# EAGLE design Laser_Array_Temp_Low_BRD_V2.2 (EAGLE 7.7.0)
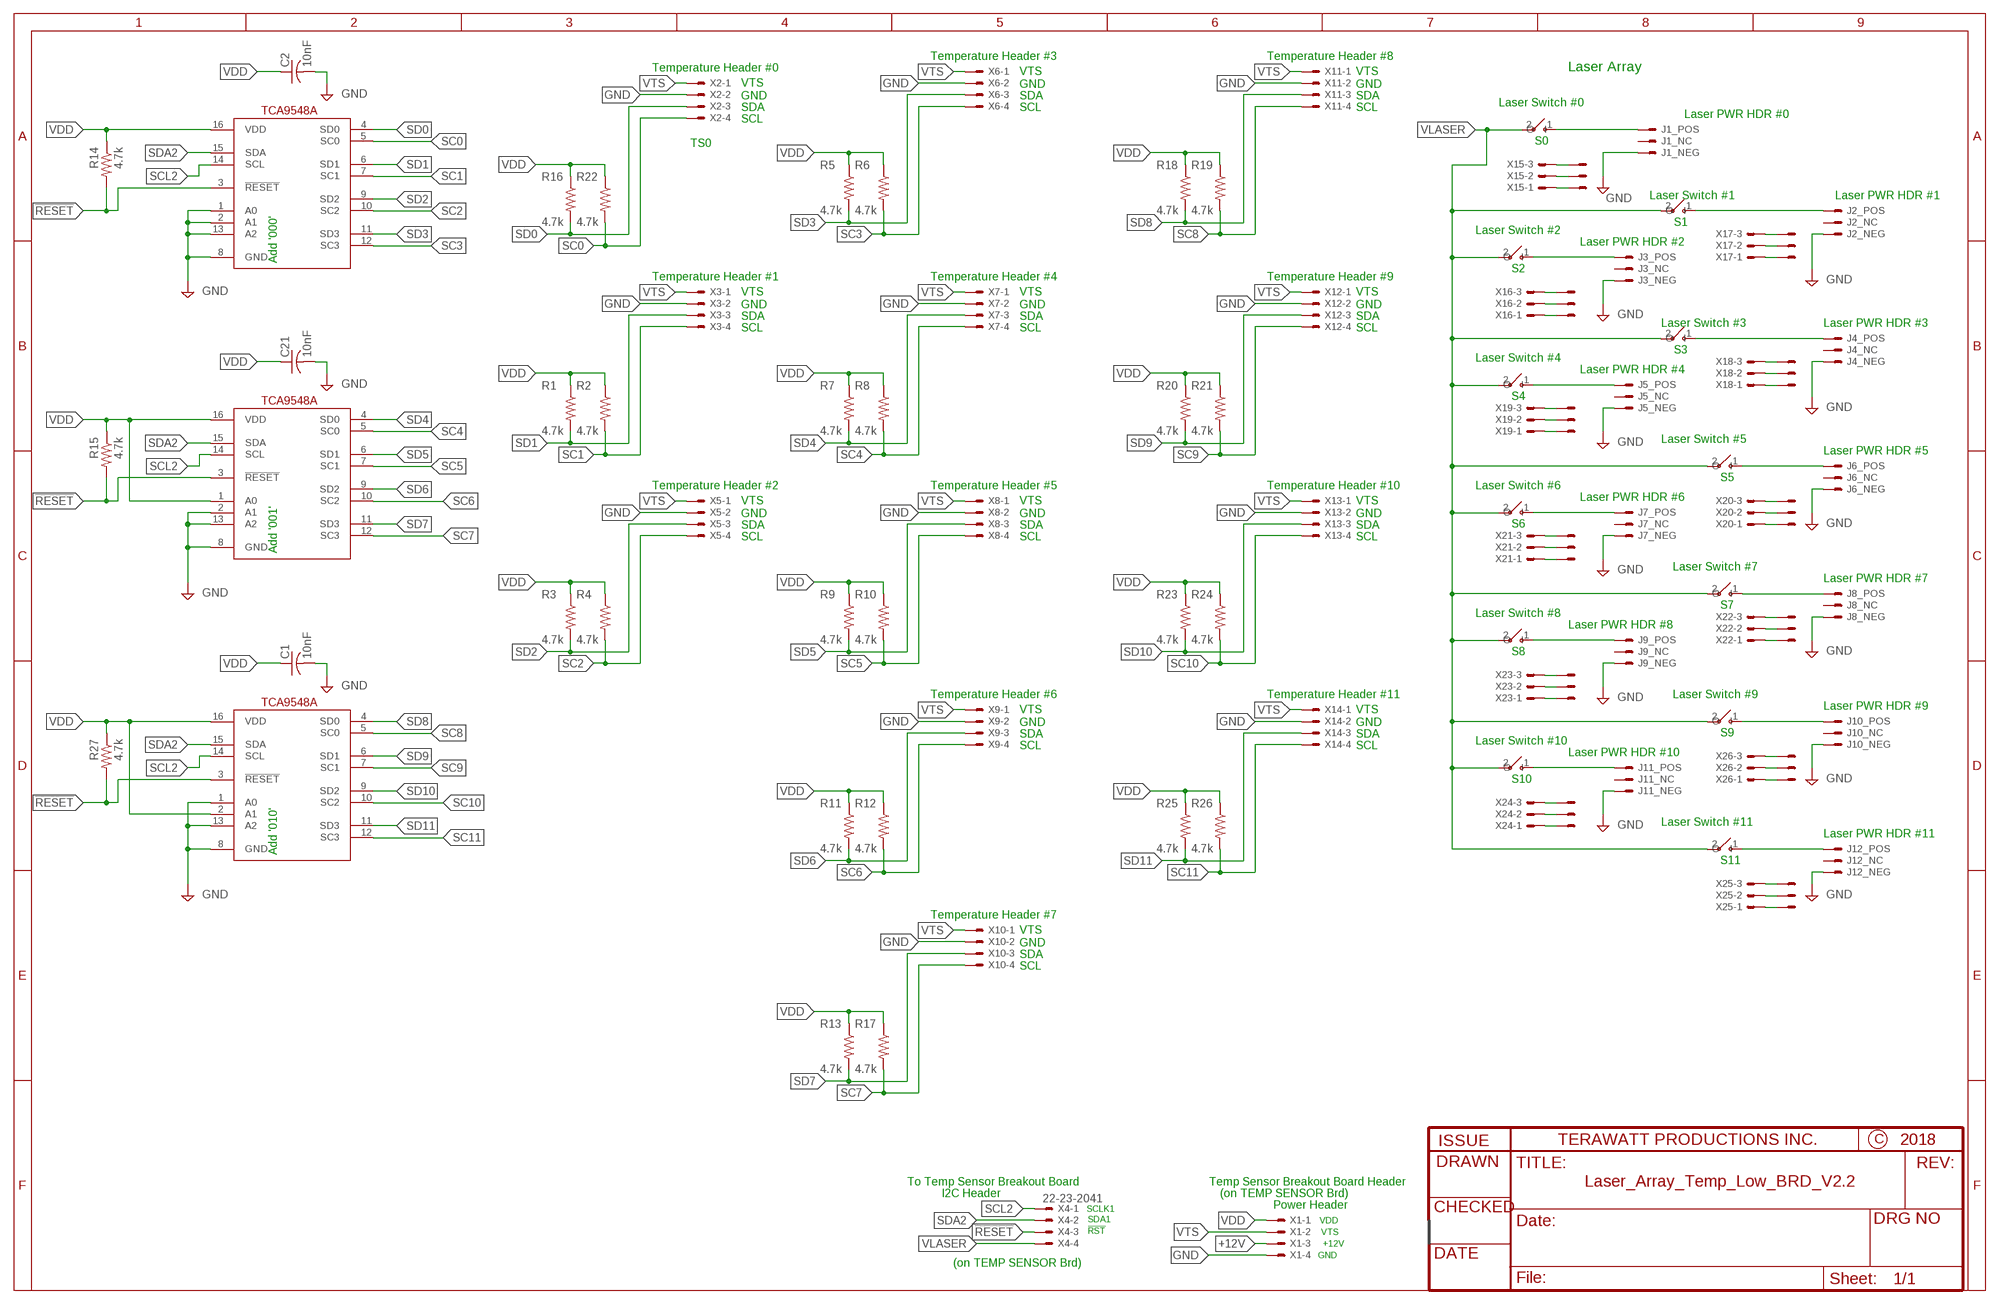
[diagram p0: schematic, sheet 1]

## Parts
C1  10nF  C-USC0805  [C0805]
C2  10nF  C-USC0805  [C0805]
C21  10nF  C-USC0805  [C0805]
J1  LASER_MOD  [LASER_MOD]
J2  LASER_MOD  [LASER_MOD]
J3  LASER_MOD  [LASER_MOD]
J4  LASER_MOD  [LASER_MOD]
J5  LASER_MOD  [LASER_MOD]
J6  LASER_MOD  [LASER_MOD]
J7  LASER_MOD  [LASER_MOD]
J8  LASER_MOD  [LASER_MOD]
J9  LASER_MOD  [LASER_MOD]
J10  LASER_MOD  [LASER_MOD]
J11  LASER_MOD  [LASER_MOD]
J12  LASER_MOD  [LASER_MOD]
R1  4.7k  R-US_M0805  [M0805]
R2  4.7k  R-US_M0805  [M0805]
R3  4.7k  R-US_M0805  [M0805]
R4  4.7k  R-US_M0805  [M0805]
R5  4.7k  R-US_M0805  [M0805]
R6  4.7k  R-US_M0805  [M0805]
R7  4.7k  R-US_M0805  [M0805]
R8  4.7k  R-US_M0805  [M0805]
R9  4.7k  R-US_M0805  [M0805]
R10  4.7k  R-US_M0805  [M0805]
R11  4.7k  R-US_M0805  [M0805]
R12  4.7k  R-US_M0805  [M0805]
R13  4.7k  R-US_M0805  [M0805]
R14  4.7k  R-US_M0805  [M0805]
R15  4.7k  R-US_M0805  [M0805]
R16  4.7k  R-US_M0805  [M0805]
R17  4.7k  R-US_M0805  [M0805]
R18  4.7k  R-US_M0805  [M0805]
R19  4.7k  R-US_M0805  [M0805]
R20  4.7k  R-US_M0805  [M0805]
R21  4.7k  R-US_M0805  [M0805]
R22  4.7k  R-US_M0805  [M0805]
R23  4.7k  R-US_M0805  [M0805]
R24  4.7k  R-US_M0805  [M0805]
R25  4.7k  R-US_M0805  [M0805]
R26  4.7k  R-US_M0805  [M0805]
R27  4.7k  R-US_M0805  [M0805]
S13  TOGGLE_SPST  [22-23-2021]
S14  TOGGLE_SPST  [22-23-2021]
S15  TOGGLE_SPST  [22-23-2021]
S16  TOGGLE_SPST  [22-23-2021]
S17  TOGGLE_SPST  [22-23-2021]
S18  TOGGLE_SPST  [22-23-2021]
S19  TOGGLE_SPST  [22-23-2021]
S20  TOGGLE_SPST  [22-23-2021]
S21  TOGGLE_SPST  [22-23-2021]
S22  TOGGLE_SPST  [22-23-2021]
S23  TOGGLE_SPST  [22-23-2021]
S24  TOGGLE_SPST  [22-23-2021]
U1  TCA9546A  [SOIC16N]
U2  TCA9546A  [SOIC16N]
U3  TCA9546A  [SOIC16N]
U$1  SINGLE_PAD  [SINGLE_PAD]
U$2  SINGLE_PAD  [SINGLE_PAD]
U$3  SINGLE_PAD  [SINGLE_PAD]
U$4  SINGLE_PAD  [SINGLE_PAD]
U$5  SINGLE_PAD  [SINGLE_PAD]
U$6  SINGLE_PAD  [SINGLE_PAD]
U$7  SINGLE_PAD  [SINGLE_PAD]
U$8  SINGLE_PAD  [SINGLE_PAD]
U$9  SINGLE_PAD  [SINGLE_PAD]
U$10  SINGLE_PAD  [SINGLE_PAD]
U$11  SINGLE_PAD  [SINGLE_PAD]
U$12  SINGLE_PAD  [SINGLE_PAD]
U$13  SINGLE_PAD  [SINGLE_PAD]
U$14  SINGLE_PAD  [SINGLE_PAD]
U$15  SINGLE_PAD  [SINGLE_PAD]
U$16  SINGLE_PAD  [SINGLE_PAD]
U$17  SINGLE_PAD  [SINGLE_PAD]
U$18  SINGLE_PAD  [SINGLE_PAD]
U$19  SINGLE_PAD  [SINGLE_PAD]
U$20  SINGLE_PAD  [SINGLE_PAD]
U$21  SINGLE_PAD  [SINGLE_PAD]
U$22  SINGLE_PAD  [SINGLE_PAD]
U$23  SINGLE_PAD  [SINGLE_PAD]
U$24  SINGLE_PAD  [SINGLE_PAD]
U$25  SINGLE_PAD  [SINGLE_PAD]
U$26  SINGLE_PAD  [SINGLE_PAD]
U$27  SINGLE_PAD  [SINGLE_PAD]
U$28  SINGLE_PAD  [SINGLE_PAD]
U$29  SINGLE_PAD  [SINGLE_PAD]
U$30  SINGLE_PAD  [SINGLE_PAD]
U$31  SINGLE_PAD  [SINGLE_PAD]
U$32  SINGLE_PAD  [SINGLE_PAD]
U$33  SINGLE_PAD  [SINGLE_PAD]
U$34  SINGLE_PAD  [SINGLE_PAD]
U$35  SINGLE_PAD  [SINGLE_PAD]
U$36  SINGLE_PAD  [SINGLE_PAD]
X1  22-23-2041  [22-23-2041]
X2  22-23-2041  [22-23-2041]
X3  22-23-2041  [22-23-2041]
X4  22-23-2041  [22-23-2041]
X5  22-23-2041  [22-23-2041]
X6  22-23-2041  [22-23-2041]
X7  22-23-2041  [22-23-2041]
X8  22-23-2041  [22-23-2041]
X9  22-23-2041  [22-23-2041]
X10  22-23-2041  [22-23-2041]
X11  22-23-2041  [22-23-2041]
X12  22-23-2041  [22-23-2041]
X13  22-23-2041  [22-23-2041]
X14  22-23-2041  [22-23-2041]
X15  22-23-2031  [22-23-2031]
X16  22-23-2031  [22-23-2031]
X17  22-23-2031  [22-23-2031]
X18  22-23-2031  [22-23-2031]
X19  22-23-2031  [22-23-2031]
X20  22-23-2031  [22-23-2031]
X21  22-23-2031  [22-23-2031]
X22  22-23-2031  [22-23-2031]
X23  22-23-2031  [22-23-2031]
X24  22-23-2031  [22-23-2031]
X25  22-23-2031  [22-23-2031]
X26  22-23-2031  [22-23-2031]

## Nets
!RESET: R14.2 R15.2 R27.2 U1.3(!RESET) U2.3(!RESET) U3.3(!RESET) X4.3
+12V: X1.3
GND: C1.2 C2.2 C21.2 J1.3 J2.3 J3.3 J4.3 J5.3 J6.3 J7.3 J8.3 J9.3 J10.3 J11.3 J12.3 U1.1(A0) U1.2(A1) U1.8(GND) U1.13(A2) U2.2(A1) U2.8(GND) U2.13(A2) U3.1(A0) U3.8(GND) U3.13(A2) X1.4 X2.2 X3.2 X5.2 X6.2 X7.2 X8.2 X9.2 X10.2 X11.2 X12.2 X13.2 X14.2
N$1: J2.1 S13.1(O)
N$2: J1.1 S16.1(O)
N$3: J3.1 S14.1(O)
N$4: J4.1 S15.1(O)
N$5: J5.1 S17.1(O)
N$6: J6.1 S18.1(O)
N$7: J7.1 S19.1(O)
N$8: J8.1 S20.1(O)
N$9: J9.1 S21.1(O)
N$10: J10.1 S22.1(O)
N$11: J11.1 S23.1(O)
N$12: J12.1 S24.1(O)
N$13: U$4.1(S) X16.3
N$14: U$1.1(S) X15.3
N$15: U$10.1(S) X18.3
N$16: U$13.1(S) X19.3
N$17: U$7.1(S) X17.3
N$18: U$16.1(S) X20.3
N$19: U$19.1(S) X21.3
N$20: U$2.1(S) X15.2
N$21: U$3.1(S) X15.1
N$22: U$5.1(S) X16.2
N$23: U$6.1(S) X16.1
N$24: U$8.1(S) X17.2
N$25: U$9.1(S) X17.1
N$26: U$11.1(S) X18.2
N$27: U$12.1(S) X18.1
N$28: U$14.1(S) X19.2
N$29: U$15.1(S) X19.1
N$30: U$17.1(S) X20.2
N$31: U$18.1(S) X20.1
N$32: U$20.1(S) X21.2
N$33: U$21.1(S) X21.1
N$34: U$22.1(S) X22.3
N$35: U$23.1(S) X22.2
N$36: U$24.1(S) X22.1
N$37: U$25.1(S) X23.3
N$38: U$26.1(S) X23.2
N$39: U$27.1(S) X23.1
N$40: U$28.1(S) X24.3
N$41: U$29.1(S) X24.2
N$42: U$30.1(S) X24.1
N$43: U$31.1(S) X25.3
N$44: U$32.1(S) X25.2
N$45: U$33.1(S) X25.1
N$46: U$34.1(S) X26.3
N$47: U$35.1(S) X26.2
N$48: U$36.1(S) X26.1
SC0: R22.2 U1.5(SC0) X2.4
SC1: R2.2 U1.7(SC1) X3.4
SC2: R4.2 U1.10(SC2) X5.4
SC3: R6.2 U1.12(SC3) X6.4
SC4: R8.2 U2.5(SC0) X7.4
SC5: R10.2 U2.7(SC1) X8.4
SC6: R12.2 U2.10(SC2) X9.4
SC7: R17.2 U2.12(SC3) X10.4
SC8: R19.2 U3.5(SC0) X11.4
SC9: R21.2 U3.7(SC1) X12.4
SC10: R24.2 U3.10(SC2) X13.4
SC11: R26.2 U3.12(SC3) X14.4
SCL2: U1.14(SCL) U2.14(SCL) U3.14(SCL) X4.1
SD0: R16.2 U1.4(SD0) X2.3
SD1: R1.2 U1.6(SD1) X3.3
SD2: R3.2 U1.9(SD2) X5.3
SD3: R5.2 U1.11(SD3) X6.3
SD4: R7.2 U2.4(SD0) X7.3
SD5: R9.2 U2.6(SD1) X8.3
SD6: R11.2 U2.9(SD2) X9.3
SD7: R13.2 U2.11(SD3) X10.3
SD8: R18.2 U3.4(SD0) X11.3
SD9: R20.2 U3.6(SD1) X12.3
SD10: R23.2 U3.9(SD2) X13.3
SD11: R25.2 U3.11(SD3) X14.3
SDA2: U1.15(SDA) U2.15(SDA) U3.15(SDA) X4.2
VDD: C1.1 C2.1 C21.1 R1.1 R2.1 R3.1 R4.1 R5.1 R6.1 R7.1 R8.1 R9.1 R10.1 R11.1 R12.1 R13.1 R14.1 R15.1 R16.1 R17.1 R18.1 R19.1 R20.1 R21.1 R22.1 R23.1 R24.1 R25.1 R26.1 R27.1 U1.16(VDD) U2.1(A0) U2.16(VDD) U3.2(A1) U3.16(VDD) X1.1
VLASER: S13.2(I) S14.2(I) S15.2(I) S16.2(I) S17.2(I) S18.2(I) S19.2(I) S20.2(I) S21.2(I) S22.2(I) S23.2(I) S24.2(I) X4.4
VTS: X1.2 X2.1 X3.1 X5.1 X6.1 X7.1 X8.1 X9.1 X10.1 X11.1 X12.1 X13.1 X14.1
Unconnected: J1.2 J2.2 J3.2 J4.2 J5.2 J6.2 J7.2 J8.2 J9.2 J10.2 J11.2 J12.2

## Notes on the sheet
- Temperature Header #3 | Temperature Header #8
- Temperature Header #0 | Laser Array
- VTS | VTS
- VTS | GND | GND
- GND | SDA | SDA
- Laser Switch #0
- SDA | SCL | SCL
- Laser PWR HDR #0
- SCL
- TS0 | S0
- Laser Switch #1 | Laser PWR HDR #1
- S1
- Laser Switch #2
- Laser PWR HDR #2
- Add '000'
- S2
- Temperature Header #1 | Temperature Header #4 | Temperature Header #9
- VTS | VTS | VTS
- GND | GND | GND
- SDA | SDA | SDA
- Laser Switch #3 | Laser PWR HDR #3
- SCL | SCL | SCL
- S3
- Laser Switch #4
- Laser PWR HDR #4
- S4
- Laser Switch #5
- Laser PWR HDR #5
- S5
- Temperature Header #2 | Temperature Header #5 | Temperature Header #10 | Laser Switch #6
- Laser PWR HDR #6
- VTS | VTS | VTS
- GND | GND | GND
- SDA | SDA | SDA | S6
- SCL | SCL | SCL
- Add '001'
- Laser Switch #7
- Laser PWR HDR #7
- S7
- Laser Switch #8
- Laser PWR HDR #8
- S8
- Temperature Header #6 | Temperature Header #11 | Laser Switch #9
- Laser PWR HDR #9
- VTS | VTS
- GND | GND
- SDA | SDA | S9
- Laser Switch #10
- SCL | SCL
- Laser PWR HDR #10
- S10
- Laser Switch #11
- Laser PWR HDR #11
- Add '010'
- S11
- Temperature Header #7
- VTS
- GND
- SDA
- SCL
- To Temp Sensor Breakout Board | Temp Sensor Breakout Board Header
- I2C Header | (on TEMP SENSOR Brd)
- Power Header
- SCLK1
- SDA1 | VDD
- !RST | VTS
- +12V
- GND
- (on TEMP SENSOR Brd)

## Library data of the parts
C1 C2 C21 = rcl:C-US: CAPACITOR, American symbol
J1-J12 = Mine:LASER_MOD
R1-R27 = rcl:R-US_: RESISTOR, American symbol
S13-S24 = Mine:TOGGLE_SPST: SPST Toggle SPST toggle switch with no package
U1-U3 = Mine:TCA9546A
U$1-U$36 = Mine:SINGLE_PAD
X1-X14 = Mine:22-23-2041: .100" (2.54mm) Center Header - 4 Pin; MF: MOLEX; MPN: 22-23-2041; OC_FARNELL: 1462920; OC_NEWARK: 38C0355
X15-X26 = Mine:22-23-2031: .100" (2.54mm) Center Header - 3 Pin; MF: MOLEX; MPN: 22-23-2031; OC_FARNELL: 1462950; OC_NEWARK: 30C0862

## Net classes
0 default: width 0.254 mm, drill 0.508 mm, clearance 0.203 mm

## Board
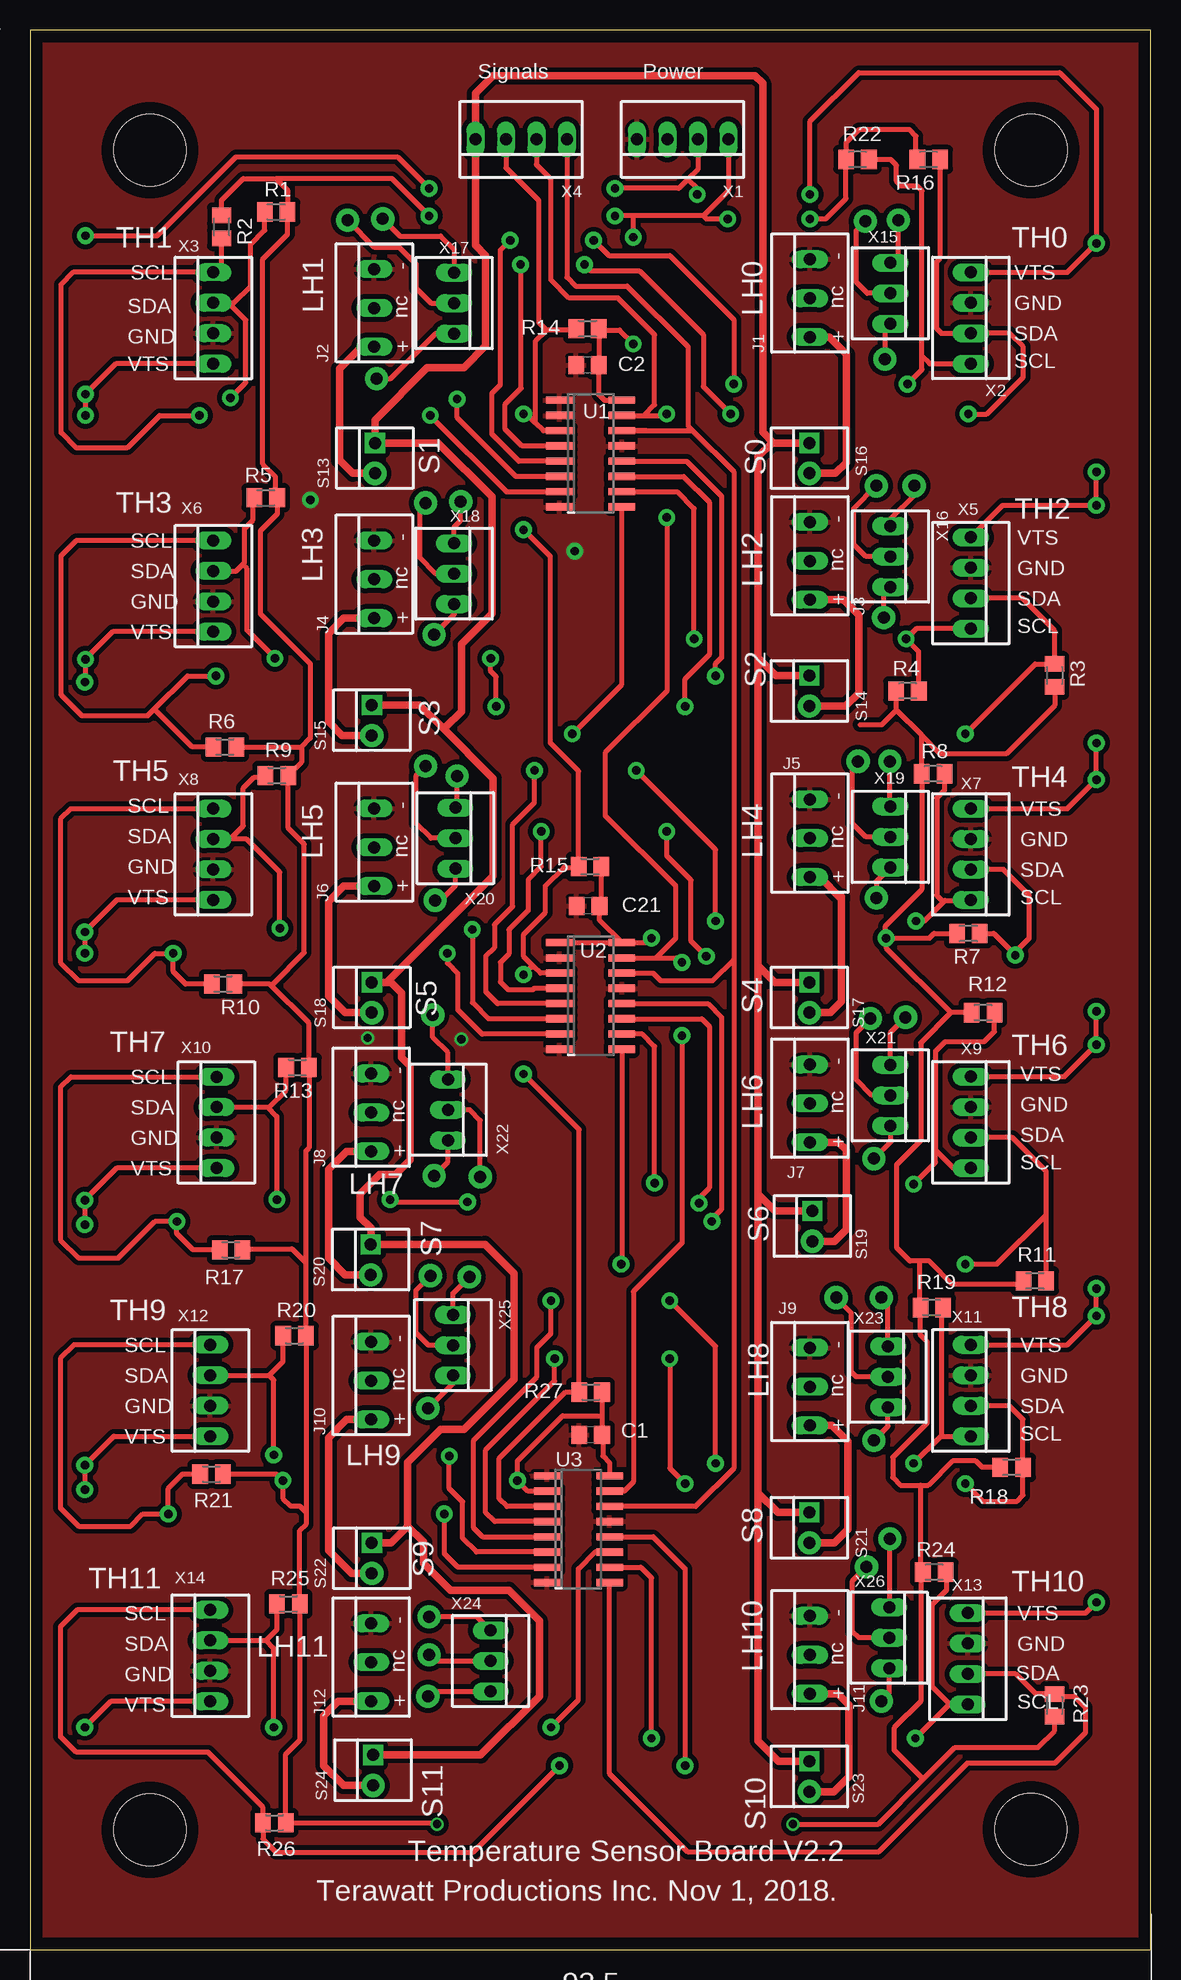
[diagram p1: board, top side]
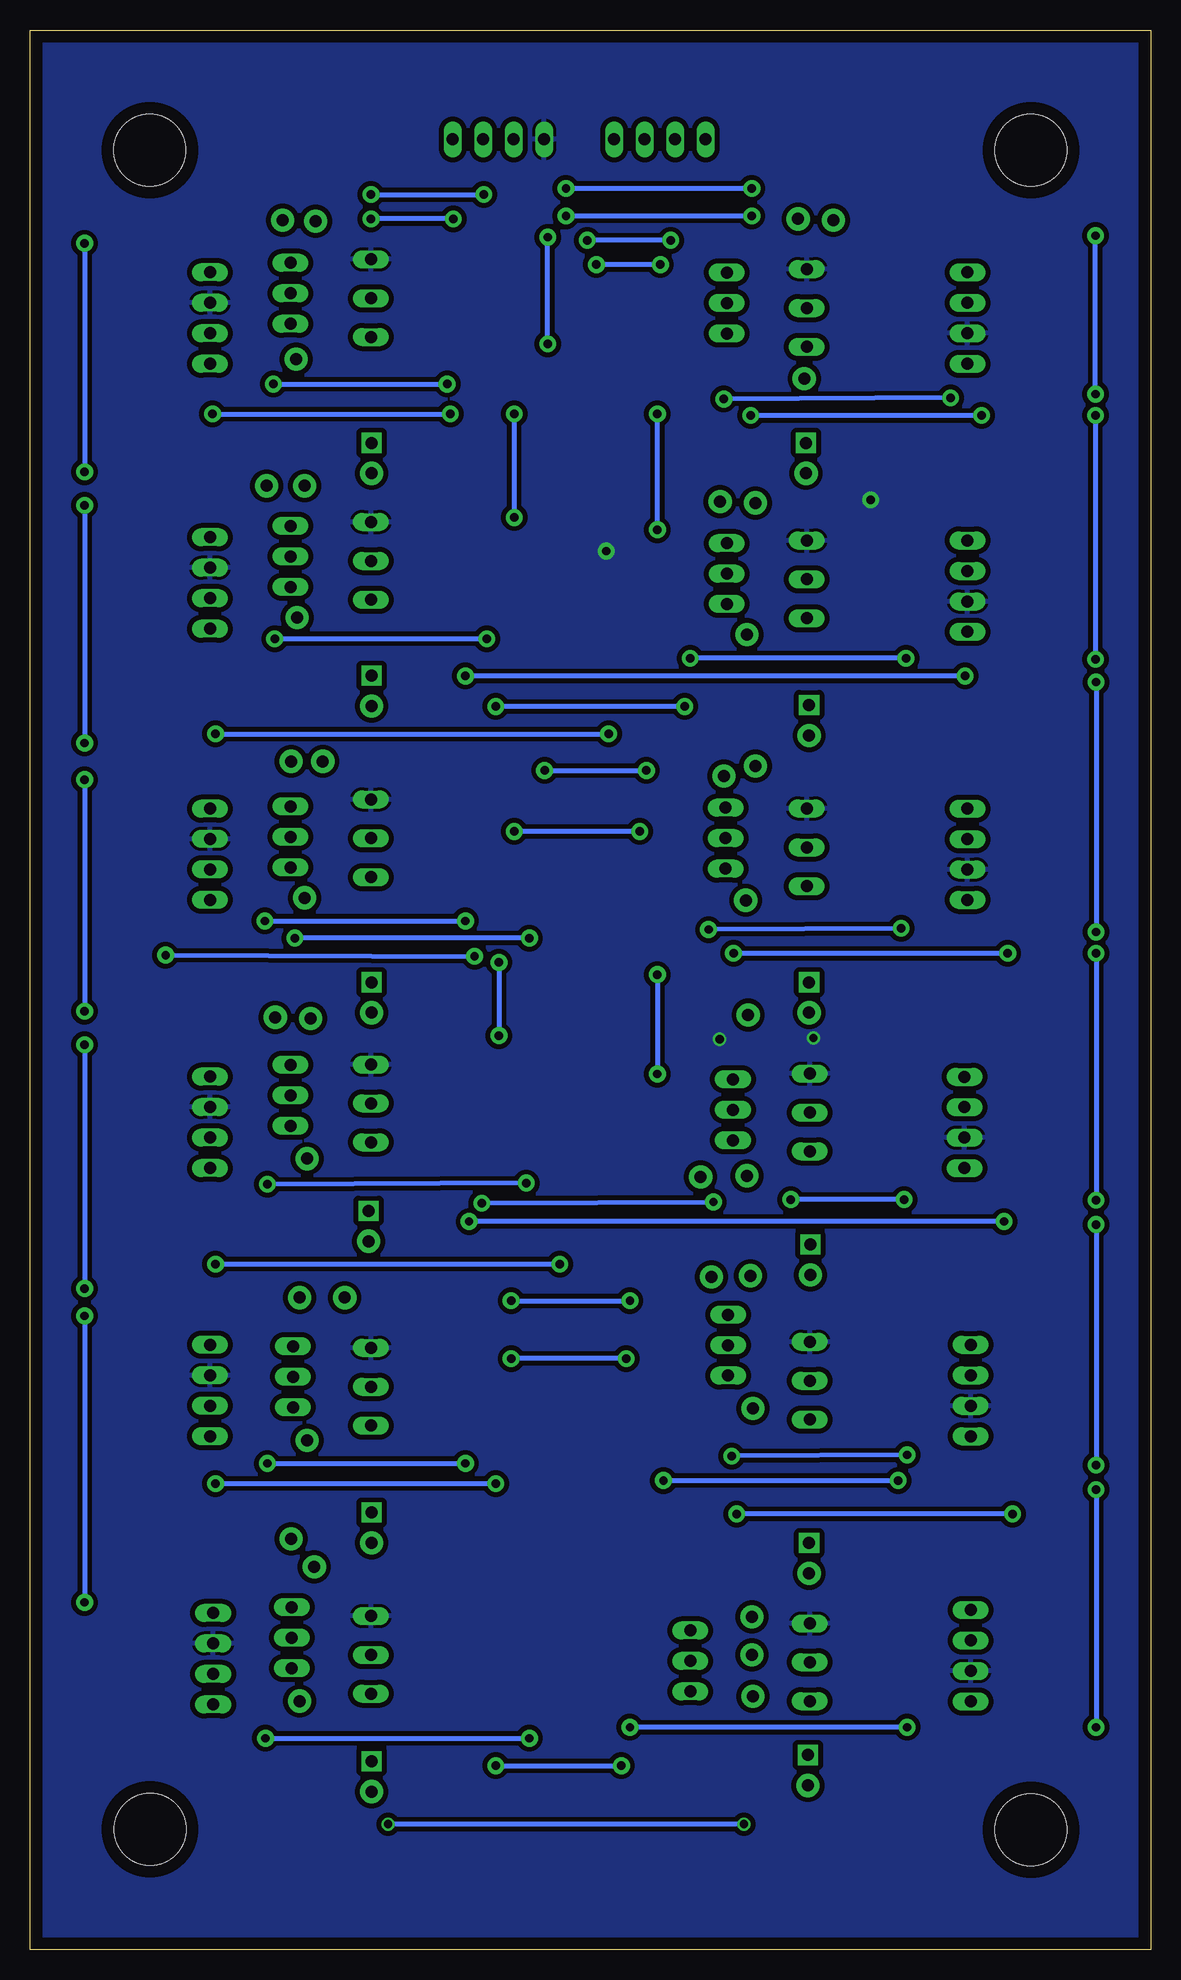
[diagram p2: board, bottom side, seen from below]

Size 93.45 x 160.02 mm. Coordinates in mm from the lower left corner, seen from the top.
Outline: 0,0 93.45,0 93.45,160.02 0,160.02 0,0
Copper layers (1*16): Top 0.035mm / dielectric 1.5mm / Bottom 0.035mm
Design rules "default *": minimum track width 10mil, minimum drill 24mil, track to track 16mil, track to pad 14mil, pad to pad 14mil, via to via 14mil, smd to smd 14mil, copper to edge 40mil, drill to drill 8mil, minimum pad ring 10mil, minimum via ring 8mil, stop-mask expansion 4mil, vias tented up to drill 0mil, thermal gap 10mil
Holes 5.99 mm at 10,10 10,150 83.44,10.04 83.46,150

### Footprints (pad centres in the part's own frame; a part is rotated, then mirrored left to right if it is on the bottom)
C0805 = smd 1.3 x 1.5: 1 -0.95,0; 2 0.95,0
LASER_MOD = drill 1 long: 1 -2.54,0; 2 0.7,0; 3 3.94,0
M0805 = smd 1.3 x 1.6: 1 -0.95,0; 2 0.95,0
22-23-2021 = drill 1 pad 1.93: 1 -1.27,0 | drill 1 pad 1.676 square: 2 1.27,0
SOIC16N = smd 0.6 x 2.2: 1 -4.445,-2.6; 2 -3.175,-2.6; 3 -1.905,-2.6; 4 -0.635,-2.6; 5 0.635,-2.6; 6 1.905,-2.6; 7 3.175,-2.6; 8 4.445,-2.6; 9 4.445,2.6; 10 3.175,2.6; 11 1.905,2.6; 12 0.635,2.6; 13 -0.635,2.6; 14 -1.905,2.6; 15 -3.175,2.6; 16 -4.445,2.6
SINGLE_PAD = drill 1 pad 1.93: 1 -1.27,0
22-23-2041 = drill 1 long: 1 -3.81,0; 2 -1.27,0; 3 1.27,0; 4 3.81,0
22-23-2031 = drill 1 long: 1 -2.54,0; 2 0,0; 3 2.54,0

### Placement (x,y rotation side)
C1  46.74,42.93 180 top
C2  46.48,132.08 180 top
C21  46.53,86.99 180 top
J1  65.02,136.96 90 top
J2  28.7,136.14 90 top
J3  65.02,115.06 90 top
J4  28.7,113.54 90 top
J5  65.02,91.95 90 top
J6  28.7,91.19 90 top
J7  65.02,69.85 90 top
J8  28.45,69.09 90 top
J9  65.02,46.23 90 top
J10  28.45,46.74 90 top
J11  65.02,23.88 90 top
J12  28.45,23.27 90 top
R1  20.52,144.86 180 top
R2  15.98,143.61 270 top
R3  85.42,106.22 90 top
R4  73.15,104.93 0 top
R5  19.66,121.03 180 top
R6  16.25,100.25 180 top
R7  78.23,84.71 0 top
R8  75.29,98.02 0 top
R9  20.58,97.87 180 top
R10  16.11,80.49 180 top
R11  83.77,55.75 0 top
R12  79.45,78.11 0 top
R13  22.3,73.53 180 top
R14  46.48,135.13 180 top
R15  46.69,90.3 180 top
R16  74.93,149.22 0 top
R17  16.77,58.34 180 top
R18  81.84,40.21 0 top
R19  75.18,53.52 0 top
R20  22.05,51.18 180 top
R21  15.14,39.65 180 top
R22  68.99,149.22 0 top
R23  85.42,20.37 90 top
R24  75.39,31.47 0 top
R25  21.54,28.83 180 top
R26  20.37,10.59 180 top
R27  46.74,46.48 180 top
S13  28.75,124.33 90 top
S14  64.97,104.93 90 top
S15  28.5,102.49 90 top
S16  64.97,124.33 90 top
S17  64.97,79.38 90 top
S18  28.5,79.37 90 top
S19  65.23,60.33 90 top
S20  28.4,57.53 90 top
S21  64.97,35.18 90 top
S22  28.5,32.64 90 top
S23  64.97,14.45 90 top
S24  28.6,14.96 90 top
U1  46.74,124.71 270 top
U2  46.74,79.5 270 top
U3  45.72,35.05 270 top
U$1  72.54,132.59 0 top
U$2  70.92,144.07 0 top
U$3  73.66,144.17 0 top
U$4  72.44,111.05 0 top
U$5  71.83,122.02 0 top
U$6  74.98,122.02 0 top
U$7  30.18,130.96 0 top
U$8  27.74,144.17 0 top
U$9  30.68,144.27 0 top
U$10  34.95,109.63 0 top
U$11  34.24,120.6 0 top
U$12  37.19,120.7 0 top
U$13  71.83,87.68 0 top
U$14  70.31,99.06 0 top
U$15  72.95,99.06 0 top
U$16  35.05,87.48 0 top
U$17  34.24,98.65 0 top
U$18  36.88,97.84 0 top
U$19  71.63,65.94 0 top
U$20  71.32,77.62 0 top
U$21  74.27,77.72 0 top
U$22  34.95,64.52 0 top
U$23  38.81,64.41 0 top
U$24  34.85,77.93 0 top
U$25  71.63,42.47 0 top
U$26  68.48,54.36 0 top
U$27  72.24,54.36 0 top
U$28  34.44,21.13 0 top
U$29  34.54,24.59 0 top
U$30  34.54,27.74 0 top
U$31  34.44,45.11 0 top
U$32  34.65,56.18 0 top
U$33  37.9,56.08 0 top
U$34  72.24,20.73 0 top
U$35  71.02,31.9 0 top
U$36  72.95,34.24 0 top
X1  54.41,150.9 180 top
X2  78.44,136.02 270 top
X3  15.29,136.02 90 top
X4  40.94,150.9 180 top
X5  78.44,113.92 270 top
X6  15.29,113.66 90 top
X7  78.44,91.31 270 top
X8  15.29,91.31 90 top
X9  78.44,68.96 270 top
X10  15.54,68.96 90 top
X11  78.44,46.61 270 top
X12  15.03,46.61 90 top
X13  78.18,24.26 270 top
X14  15.03,24.51 90 top
X15  71.73,138.07 270 top
X16  71.73,116.13 270 top
X17  35.36,137.26 270 top
X18  35.36,114.71 270 top
X19  71.73,92.76 270 top
X20  35.46,92.66 270 top
X21  71.73,71.22 270 top
X22  34.85,70 270 top
X23  71.53,47.75 270 top
X24  38.4,24.08 270 top
X25  35.26,50.39 270 top
X26  71.63,26.01 270 top

### Tracks (layer width: path | path; a pad name or v marks a point on that pad's centre or on a via)
!RESET  (via drill 0.7 pad 1.4)
  Top 0.406: U1.3 42.8,126.62 42.16,127.25 | 42.16,127.25 42.16,134.11 43.05,135 | R14.2 45.41,135 43.05,135 | 42.16,127.25 41.4,128.02 v41.15,128.02 | 43.05,135 42.42,135.64 42.42,145.8 39.67,148.54 X4.3 | U2.3 42.55,81.41 42.04,81.92 | 42.04,81.92 41.15,82.8 41.15,84.63 42.98,86.46 42.98,88.7 44.5,90.22 45.66,90.22 R15.2 45.74,98.23 43.38,100.58 43.38,116.13 v41.15,118.36 | U3.3 39.75,36.96 39.12,37.59 39.12,40.95 44.65,46.48 R27.2 45.79,68.36 v41.15,73 | v41.15,81.28 41.78,81.92 42.04,81.92
  Bottom 0.406: v41.15,118.36 v41.15,128.02 | v41.15,81.28 v41.15,73
GND  (via drill 0.7, 0.7 pad 1.4)
  other vias: 23.37,120.85 45.42,116.59 28.14,76 35.97,75.9
  pour Top: 0,160.1 93.47,159.84 93.47,-0.25 0,0
  pour Bottom: 0,160.1 94.23,159.84 94.23,-0.25 0.25,0
N$1
  Top 0.61: S13.1 26.9,123.06 25.81,124.16 25.81,131.78 27.64,133.6 J2.1
N$2
  Top 0.61: S16.1 67.16,123.06 68.07,123.98 68.07,132.99 66.65,134.42 J1.1
N$3
  Top 0.61: J3.1 67.82,112.52 69.09,111.25 69.09,104.75 68,103.66 S14.1
N$4
  Top 0.61: S15.1 26.04,101.22 24.89,102.36 24.89,109.73 26.16,111 J4.1
N$5
  Top 0.61: S17.1 66.73,78.11 67.67,79.05 67.67,87.58 | 67.67,87.58 65.84,89.41 J5.1 | 67.67,87.58 67.67,87.78
N$6
  Top 0.61: S18.1 26.29,78.1 24.89,79.5 24.89,87.38 26.16,88.65 J6.1
N$7
  Top 0.61: J7.1 67.41,67.31 68.07,66.65 68.07,60.05 67.08,59.05 S19.1
N$8
  Top 0.61: S20.1 26.29,56.26 24.89,57.66 24.89,65.02 26.42,66.55 J8.1
N$9
  Top 0.61: J9.1 66.85,43.69 68.17,42.37 68.17,35.05 67.06,33.93 65,33.93 S21.1
N$10
  Top 0.61: S22.1 26.8,31.37 24.89,33.27 24.89,42.67 26.42,44.2 J10.1
N$11
  Top 0.61: J11.1 67.36,21.34 68.28,20.42 68.28,14.43 67.03,13.18 S23.1
N$12
  Top 0.61: J12.1 25.7,20.73 24.49,19.51 24.49,15.34 26.14,13.69 S24.1
N$13
  Top 0.406: U$4.1 71.17,113.03 X16.3
N$14
  Top 0.406: X15.3 71.27,135.08 U$1.1
N$15
  Top 0.406: U$10.1 35.36,111.3 X18.3
N$16
  Top 0.406: X19.3 70.56,89.05 U$13.1
N$17
  Top 0.406: U$7.1 30.07,130.96 33.83,134.72 X17.3
N$18
  Top 0.406: U$16.1 34.24,87.48 35.46,88.7 X20.3
N$19
  Top 0.406: X21.3 71.73,67.31 U$19.1
N$20
  Top 0.406: X15.2 69.8,138.07 68.89,138.99 68.89,143.31 U$2.1
N$21
  Top 0.406: X15.1 72.39,141.28 U$3.1
N$22
  Top 0.406: X16.2 69.7,116.13 68.68,117.14 68.68,120.14 U$5.1
N$23
  Top 0.406: X16.1 71.73,119.28 73.71,121.26 U$6.1
N$24
  Top 0.406: U$8.1 28.7,141.94 30.79,141.94 32.21,140.51 32.21,138.48 33.43,137.26 X17.2
N$25
  Top 0.406: U$9.1 30.84,142.85 34.24,142.85 35.36,141.73 X17.1
N$26
  Top 0.406: X18.2 33.83,114.71 32.51,116.03 32.51,120.14 U$11.1
N$27
  Top 0.406: X18.1 35.36,118.57 35.92,119.13 U$12.1
N$28
  Top 0.406: X19.2 69.7,92.76 68.58,93.88 68.58,98.6 U$14.1
N$29
  Top 0.406: X19.1 71.68,95.35 U$15.1
N$30
  Top 0.406: X20.2 33.43,92.66 32.21,93.88 32.21,97.89 U$17.1
N$31
  Top 0.406: X20.1 35.61,95.35 U$18.1
N$32
  Top 0.406: X21.2 70.21,71.22 68.89,72.54 68.89,76.45 U$20.1
N$33
  Top 0.406: X21.1 71.73,76.45 U$21.1
N$34
  Top 0.406: U$22.1 34.85,65.68 X22.3
N$35
  Top 0.406: U$23.1 37.54,69.14 36.68,70 X22.2
N$36
  Top 0.406: X22.1 34.85,74.78 33.58,76.05 U$24.1
N$37
  Top 0.406: U$25.1 71.53,43.64 X23.3
N$38
  Top 0.406: X23.2 68.89,47.75 68.48,48.16 68.48,53.09 U$26.1
N$39
  Top 0.406: X23.1 71.53,53.8 U$27.1
N$40
  Top 0.406: U$28.1 33.58,21.54 X24.3
N$41
  Top 0.406: U$29.1 33.78,24.08 X24.2
N$42
  Top 0.406: X24.1 37.29,27.74 U$30.1
N$43
  Top 0.406: X25.3 35.26,47.19 U$31.1
N$44
  Top 0.406: X25.2 33.22,50.39 32.21,51.41 32.21,55.02 U$32.1
N$45
  Top 0.406: X25.1 35.26,54.71 U$33.1
N$46
  Top 0.406: U$34.1 71.63,21.39 X26.3
N$47
  Top 0.406: X26.2 69.09,26.01 68.58,26.52 68.58,30.73 U$35.1
N$48
  Top 0.406: X26.1 71.68,28.6 U$36.1
SC0  (via drill 0.7 pad 1.4)
  Top 0.406: U1.5 40.77,124.08 38.51,126.34 38.51,129.74 39.22,130.45 39.22,141.68 v40.03,142.49 | v46.99,142.49 48.26,141.22 53.34,141.22 58.67,135.89 v58.67,130.5 | X2.4 75.01,132.21 74.37,132.84 | 70.06,149.35 R22.2 71.75,149.22 72.24,148.74 72.24,147.42 72.64,147.01 73.97,147.01 74.37,146.61 74.37,132.84 | v73.15,130.5 74.37,131.72 74.37,132.84
  Bottom 0.406: v73.15,130.5 v58.67,130.5 | v40.03,142.49 v46.99,142.49
SC1  (via drill 0.7 pad 1.4)
  Top 0.406: v14.12,127.89 10.79,127.89 8.13,125.22 3.81,125.22 2.59,126.44 2.59,138.81 3.6,139.83 X3.4 15.98,140.52 R2.2 | v33.37,127.89 39.72,121.54 U1.7
  Bottom 0.406: v14.12,127.89 v33.37,127.89
SC2  (via drill 0.7 pad 1.4)
  Top 0.406: U1.10 53.98,121.54 55.37,120.14 v55.37,109.27 | R4.2 74.1,108.22 v73.05,109.27 73.89,110.11 X5.4
  Bottom 0.406: v73.05,109.27 v55.37,109.27
SC3  (via drill 0.7 pad 1.4)
  Top 0.406: U1.12 54.74,124.08 57.66,121.16 57.66,107.7 57.15,107.19 v57.15,106.17 | X6.4 3.86,117.47 2.59,116.2 2.59,104.6 4.32,102.87 9.83,102.87 10.37,103.42 | 10.37,103.42 13.13,106.17 v15.49,106.17 | R6.2 13.54,100.25 10.37,103.42
  Bottom 0.406: v15.49,106.17 v57.15,106.17
SC4  (via drill 0.7 pad 1.4)
  Top 0.406: U2.5 38.99,78.87 38,79.86 38,82.8 38.71,83.52 38.71,85.45 40.23,86.97 40.23,93.78 42.06,95.61 v42.06,98.3 | 50.55,98.04 v50.55,98.3 57.15,91.69 v57.15,85.75 | 76.15,87.33 74.57,85.75 v73.86,85.75 | 76.15,87.33 76.3,87.48 78.41,87.48 X7.4 | R8.2 76.24,96.66 75.59,96.01 75.59,87.88 76.15,87.33
  Bottom 0.406: v73.86,85.75 v57.15,85.75 | v50.55,98.3 v42.06,98.3
SC5  (via drill 0.7 pad 1.4)
  Top 0.406: U2.7 37.69,76.33 35.66,78.36 35.66,81.38 34.8,82.25 v34.8,83.06 | X8.4 3.43,95.12 2.54,94.23 2.54,82.3 4.06,80.77 8.13,80.77 10.41,83.06 v11.94,83.06 11.94,81.53 12.98,80.49 R10.2
  Bottom 0.406: v11.94,83.06 v34.8,83.06
SC6  (via drill 0.7 pad 1.4)
  Top 0.406: U2.10 51.05,76.33 52.07,75.31 v52.07,63.91 | 75.49,66.65 75.49,74.88 76.3,75.69 79.55,75.69 80.4,76.54 R12.2 | X9.4 76.99,65.15 75.49,66.65 | v73.66,63.8 75.49,65.63 75.49,66.65
  Bottom 0.406: v52.07,63.91 v73.66,63.8
SC7  (via drill 0.7 pad 1.4)
  Top 0.406: U2.12 56.52,78.87 57.66,77.72 57.66,61.72 56.84,60.91 v56.84,60.71 | X10.4 3.43,72.77 2.54,71.88 2.54,59.18 4.06,57.66 7.37,57.66 10.41,60.71 v12.24,60.71 12.24,59.69 13.59,58.34 R17.2
  Bottom 0.406: v12.24,60.71 v56.84,60.71
SC8  (via drill 0.7 pad 1.4)
  Top 0.406: v53.34,54.1 57.15,50.29 v57.15,40.54 | U3.5 37.72,34.42 36.98,35.15 36.98,42.47 42.27,47.75 42.27,50.19 43.43,51.36 v43.43,54.1 | 76,42.8 X11.4 | 76,42.8 76,53.38 R19.2 | v73.66,40.54 75.92,42.8 76,42.8
  Bottom 0.406: v73.66,40.54 v57.15,40.54 | v53.34,54.1 v43.43,54.1
SC9  (via drill 0.7 pad 1.4)
  Top 0.406: U3.7 35.69,31.88 34.54,33.02 v34.54,36.32 | X12.4 3.68,50.42 2.54,49.28 2.54,36.83 4.06,35.31 8.38,35.31 9.4,36.32 v11.53,36.32 11.53,38.46 12.73,39.65 R21.2
  Bottom 0.406: v11.53,36.32 v34.54,36.32
SC10  (via drill 0.7 pad 1.4)
  Top 0.406: U3.10 50.93,31.88 51.82,30.99 v51.82,17.63 | R24.2 76.4,31.41 76.4,29.97 75.18,28.75 75.18,21.95 76.68,20.45 | 76.68,20.45 77.32,20.45 X13.4 | v73.81,17.63 76.63,20.45 76.68,20.45
  Bottom 0.406: v73.81,17.63 v51.82,17.63
SC11  (via drill 0.7 pad 1.4)
  Top 0.406: U3.12 51.94,34.42 54.61,31.75 v54.61,15.34 | X14.4 3.94,28.32 2.54,26.92 2.54,17.78 3.86,16.46 14.83,16.46 19.42,11.87 R26.2 19.42,9.23 20.52,8.13 36.93,8.13 v44.15,15.34
  Bottom 0.406: v54.61,15.34 v44.15,15.34
SCL2
  Top 0.406: 51.44,126.62 U1.14 55.24,126.62 | 55.24,126.62 58.67,123.19 58.67,82.55 | U2.14 51.94,81.41 52.58,80.77 56.9,80.77 58.67,82.55 | 58.67,82.55 58.67,40.13 55.5,36.96 U3.14 | 55.24,126.62 54.86,127 54.86,133.6 49.78,138.68 45.47,138.68 44.76,139.4 X4.1
SD0  (via drill 0.7 pad 1.4)
  Top 0.406: U1.4 41.02,125.35 39.62,126.75 39.62,128.83 40.95,130.15 40.95,140.41 v40.89,140.46 | v58.42,128.02 56.13,130.3 56.13,134.62 50.8,139.95 46.74,139.95 v46.23,140.46 | v78.23,128.02 79.76,128.02 82.8,131.06 82.8,133.6 81.66,134.75 X2.3 75.97,134.75 75.59,135.13 75.59,140.72 75.88,141.01 R16.2
  Bottom 0.406: v78.23,128.02 v58.42,128.02 | v40.89,140.46 v46.23,140.46
SD1  (via drill 0.7 pad 1.4)
  Top 0.406: U1.6 40.51,122.81 35.61,127.71 v35.61,129.26 | R1.2 19.57,143.32 18.39,142.14 18.39,138.68 16.99,137.29 X3.3 16.54,137.29 17.98,135.84 17.98,130.63 v16.71,129.36
  Bottom 0.406: v16.71,129.36 v35.61,129.26
SD2  (via drill 0.7 pad 1.4)
  Top 0.406: U1.9 49.34,105.47 v45.21,101.35 | X5.3 82.73,112.65 85.42,109.96 R3.2 83.81,107.17 v77.98,101.35
  Bottom 0.406: v77.98,101.35 v45.21,101.35
SD3  (via drill 0.7 pad 1.4)
  Top 0.406: U1.11 54.48,122.81 56.64,120.65 56.64,107.95 54.61,105.92 v54.61,103.63 | X6.3 17.2,114.93 17.73,115.47 | 17.73,115.47 18.09,115.11 18.09,109.98 v20.42,107.64 | v38.86,103.63 38.86,106.12 38.41,106.58 v38.41,107.64 | 17.73,115.47 17.88,115.62 17.88,118.47 18.59,119.18 18.59,120.92 R5.2
  Bottom 0.406: v20.42,107.64 v38.41,107.64 | v38.86,103.63 v54.61,103.63
SD4  (via drill 0.7 pad 1.4)
  Top 0.406: U2.4 42.04,80.14 41.91,80.01 39.88,80.01 39.22,80.67 39.22,82.3 39.93,83.01 39.93,85.04 41.55,86.67 41.55,89.2 42.62,90.27 v42.62,93.22 | v56.39,82.8 55.12,84.07 55.12,89.15 53.09,91.19 v53.09,93.22 | X7.3 81.15,90.04 83.31,87.88 83.31,84.33 82.14,83.16 v82.14,82.91 80.34,84.71 R7.2
  Bottom 0.406: v82.14,82.91 v56.39,82.8 | v42.62,93.22 v53.09,93.22
SD5  (via drill 0.7 pad 1.4)
  Top 0.406: U2.6 38.23,77.6 36.88,78.94 v36.88,85.04 | R9.2 19.5,97.74 18.69,97.74 17.78,96.83 17.78,93.67 16.69,92.58 X8.3 18.06,92.58 20.83,89.81 v20.83,85.14
  Bottom 0.406: v20.83,85.14 v36.88,85.04
SD6  (via drill 0.7 pad 1.4)
  Top 0.406: U2.9 49.34,57.21 v49.28,57.15 | X9.3 81.92,67.69 84.72,64.89 84.72,61.57 84.72,61.25 | R11.2 84.72,61.25 | v77.98,57.15 80.62,57.15 84.72,61.25
  Bottom 0.406: v77.98,57.15 v49.28,57.15
SD7  (via drill 0.7 pad 1.4)
  Top 0.406: U2.11 56.01,77.6 56.64,76.96 56.64,63.5 55.78,62.64 v55.78,62.23 | X10.3 19.81,70.23 | 19.81,70.23 19.94,70.23 21.34,71.63 21.34,73.52 R13.2 | 19.81,70.23 20.57,69.47 v20.57,62.53 | v30.02,62.53 30.23,62.33 v36.47,62.33
  Bottom 0.406: v20.57,62.53 v30.02,62.53 | v55.78,62.23 v36.47,62.33
SD8  (via drill 0.7 pad 1.4)
  Top 0.406: U3.4 38.73,35.69 38,36.42 38,41.66 43.74,47.4 v43.74,49.28 | v53.34,49.28 53.34,40.13 v54.61,38.86 | X11.3 81.66,45.34 82.79,44.21 R18.2 82.79,37.88 82.3,37.39 79.45,37.39 v77.98,38.86
  Bottom 0.406: v77.98,38.86 v54.61,38.86 | v43.74,49.28 v53.34,49.28
SD9  (via drill 0.7 pad 1.4)
  Top 0.406: U3.6 37.21,33.15 36.07,34.29 36.07,37.34 34.95,38.46 v34.95,41.15 | X12.3 19.94,47.88 | 19.94,47.88 21.1,49.04 R20.2 | v20.32,41.25 20.32,47.5 19.94,47.88
  Bottom 0.406: v20.32,41.25 v34.95,41.15
SD10
  Top 0.406: U3.9 48.32,14.67 54.86,8.13 70.71,8.13 78.13,15.54 85.45,15.54 87.99,18.09 87.99,20.22 87.07,21.13 85.61,21.13 R23.2 | X13.3 82.17,22.99 83.83,21.32 R23.2 | 85.44,21.34 R23.2
SD11  (via drill 0.7 pad 1.4)
  Top 0.406: U3.11 47.12,33.15 45.72,31.75 45.72,27.84 45.72,26.92 45.72,20.83 v43.43,18.54 | X14.3 19.68,25.78 | 19.68,25.78 20.59,26.69 R25.2 | v20.32,18.54 20.32,25.14 19.68,25.78
  Bottom 0.406: v20.32,18.54 v43.43,18.54
SDA2  (via drill 0.7 pad 1.4)
  Top 0.406: U3.15 49.53,38.23 50.29,38.99 50.29,54.86 54.36,58.93 v54.36,76.2 | v53.09,128.02 52.96,127.89 U1.15 51.18,127.89 52.07,128.78 52.07,134.62 49.02,137.67 44.96,137.67 43.43,139.19 43.43,147.57 42.22,148.79 X4.2 | v53.09,119.38 53.09,104.9 47.95,99.77 47.95,94.54 53.85,88.65 53.85,84.33 52.2,82.68 U2.15 53.98,82.68 v54.36,82.3
  Bottom 0.406: v53.09,128.02 v53.09,119.38 | v54.36,82.3 v54.36,76.2
VDD  (via drill 0.7, 0.7 pad 1.4)
  Top 0.406: U1.16 47.88,129.16 47.43,129.61 C2.1 R14.1 47.56,135 49.15,135 v50.29,133.86 | 50.29,144.53 v48.77,144.53 | v50.29,142.75 50.29,144.53 | v71.37,84.33 71.37,84.58 71.63,84.33 74.98,84.33 75.36,84.71 R7.1 | 56.13,144.53 50.29,144.53 | 56.13,144.53 58.22,146.61 X1.1 | 56.13,144.53 56.39,144.27 v58.17,144.27 | U2.1 U2.16 | U2.16 47.48,85.8 C21.1 47.64,87.15 R15.1 | R27.1 47.69,44.5 | 47.69,44.5 C1.1 47.75,42.86 47.75,41.15 48.32,40.58 U3.16 | U3.2 41.53,38.23 v40.64,39.12 40.64,40.74 44.4,44.5 47.69,44.5 | U2.16 51.44,83.95 v51.82,84.33 | 23,36.47 R20.1 23,57.3 | 23,36.47 23,35.45 22.49,34.94 R25.1 22.49,17.48 21.32,16.31 R26.1 33.81,10.59 v33.93,10.46 | R3.1 85.42,103.71 81.38,99.67 75.89,99.67 74.34,101.23 | R11.1 82.64,55.58 | R18.1 79.38,40.21 78.84,40.74 76.91,40.74 74.88,38.71 74.27,38.71 | 23,57.3 23,66.6 23.25,66.85 R13.1 23.25,77.23 20.07,80.42 | R21.1 20.55,39.65 v21.08,39.12 21.08,37.64 21.74,36.98 22.49,36.98 23,36.47 | v63.6,10.46 70.71,10.46 74.57,14.33 | R2.1 15.98,145.82 17.78,147.62 20.52,147.62 | R1.1 21.47,142.98 19.41,140.92 19.41,123.85 20.42,122.83 20.42,121.22 R5.1 20.61,119.67 19.2,118.26 19.2,111.35 23.37,107.19 23.37,100.99 22.63,100.25 | 20.52,147.62 21.47,146.68 R1.1 | R1.1 21.8,144.53 | 69.19,102.11 71.02,102.11 72.24,103.33 | 72.24,103.33 72.24,104.89 R4.1 | 74.34,101.23 72.24,103.33 | 74.34,101.23 R8.1 74.34,88.36 71.32,85.34 71.32,84.38 v71.37,84.33 | R6.1 22.63,100.25 | 22.63,100.25 22.63,98.97 R9.1 | 20.07,80.42 19.99,80.49 R10.1 | R9.1 21.54,97.86 | 20.07,80.42 20.17,80.42 22.86,83.11 22.86,92.15 21.53,93.48 R9.1 | v65.02,144.27 66.34,144.27 68.04,145.96 R22.1 68.04,150.64 69.09,151.69 73.36,151.69 73.86,151.18 73.86,149.34 R16.1
  Top 0.406: v33.27,144.53 30.18,147.62 20.52,147.62 | R12.1 76.78,78.11 | 76.78,78.11 74.27,75.59 74.27,67.46 72.24,65.43 72.24,58.52 73.36,57.4 74.17,57.4 | v71.37,84.33 71.37,83.52 76.78,78.11 | R17.1 17.79,58.42 21.84,58.42 22.96,57.3 23,57.3 | 82.64,55.58 82.8,55.41 | 82.64,55.58 82.54,55.47 76.91,55.47 74.98,57.4 74.17,57.4 | 74.17,57.4 74.17,53.58 R19.1 74.23,51.24 74.78,50.7 74.78,43.89 71.93,41.05 71.93,39.35 72.58,38.71 74.27,38.71 | 74.27,38.71 74.27,31.64 R24.1 74.27,31.3 74.27,20.73 72.03,18.49 72.03,16.66 74.37,14.33 74.57,14.33 | 85.14,19.14 R23.1 85.42,18.26 84.02,16.87 77.11,16.87 74.57,14.33
  Bottom 0.406: v48.77,144.53 v33.27,144.53 | v50.29,133.86 v50.29,142.75 | v58.17,144.27 v65.02,144.27 | v51.82,84.33 v71.37,84.33 | v40.64,39.12 v21.08,39.12 | v33.93,10.46 v63.6,10.46
VLASER
  Top 0.61: 60.71,107.7 60.71,124.46 61.85,125.6 61.98,125.6 | 60.71,107.7 60.71,82.04 | 60.71,82.04 60.71,62.99 | 60.71,62.99 60.71,38.1 | 60.71,38.1 60.71,17.42 62.41,15.72 S23.2 | S16.2 61.98,125.6 | S17.2 62.1,80.64 60.71,82.04 | S19.2 62.1,61.59 60.71,62.99 | S21.2 62.36,36.45 60.71,38.1 | 31.5,35.31 32.82,33.98 32.82,32.21 35.05,29.97 39.93,29.97 42.47,27.43 42.47,21.13 37.57,16.23 S24.2 | 31.5,35.31 30.1,33.91 S22.2 | 61.98,125.6 61.09,126.49 61.09,155.57 60.45,156.21 38.61,156.21 37.13,154.74 X4.4 37.13,142.09 38,141.22 38,133.71 36.17,131.88 33.12,131.88 28.75,127.5 S13.2 28.77,125.58 34.04,125.58 38.51,121.11 38.51,111.35 35.97,108.81 35.97,103.23 34.65,101.91 34.34,101.91 | S14.2 62.2,106.2 60.71,107.7 | S15.2 32.49,103.76 34.34,101.91 | 34.34,101.91 38.61,97.64 38.61,89.51 29.74,80.64 S18.2 | S18.2 28.52,80.67 | S18.2 30.1,80.64 30.99,79.76 30.99,74.37 31.7,73.66 31.7,65.84 30.48,64.62 29.16,64.62 27.53,62.99 27.53,61.06 28.45,60.15 28.45,58.85 S20.2 37.92,58.8 40.34,56.39 40.34,47.55 36.17,43.38 34.24,43.38 31.5,40.64 31.5,35.31
VTS  (via drill 0.7 pad 1.4)
  Top 0.406: 54.86,147.57 54.1,146.81 v48.77,146.81 | X12.1 6.98,42.8 v4.57,40.39 v4.57,38.35 | 54.86,147.57 55.63,146.81 v55.63,146.3 | X6.1 6.91,109.85 v4.62,107.57 4.62,105.71 v4.57,105.66 | v4.62,127.89 v4.62,129.67 7.16,132.21 X3.1 | X8.1 7.24,87.5 v4.57,84.84 v4.57,83.06 | X10.1 7.24,65.15 v4.57,62.48 v4.57,60.45 | X14.1 6.73,20.7 v4.57,18.54 | X2.1 86.49,139.83 v88.9,142.24 88.9,153.42 85.85,156.46 69.09,156.46 65.02,152.4 v65.02,146.3 | X5.1 81.1,120.4 v88.9,120.4 v88.9,123.19 | X7.1 86.49,95.12 v88.9,97.54 v88.9,100.58 | X9.1 86.23,72.77 v88.9,75.44 v88.9,78.23 | X11.1 86.49,50.42 v88.9,52.83 v88.9,55.12 | X13.1 88.01,28.07 v88.9,28.96 | X1.2 55.68,148.39 54.86,147.57 | v33.27,146.81 30.63,149.45 17.17,149.45 10.59,142.87 v4.62,142.87
  Bottom 0.406: v4.62,127.89 v4.62,107.57 | v4.62,129.67 v4.62,142.87 | v4.57,105.66 v4.57,84.84 | v4.57,83.06 v4.57,62.48 | v48.77,146.81 v33.27,146.81 | v4.57,60.45 v4.57,40.39 | v4.57,38.35 v4.57,18.54 | v88.9,142.24 v88.9,123.19 | v88.9,120.4 v88.9,100.58 | v88.9,97.54 v88.9,78.23 | v88.9,75.44 v88.9,55.12 | v88.9,52.83 v88.9,28.96 | v65.02,146.3 v55.63,146.3

### Text on the board
tPlace: Signals | Power | TH1 | TH0 | SCL | VTS | GND | SDA | LH1 | LH0 | GND | SDA | VTS | SCL | S0 | S1 | TH3 | TH2 | SCL | VTS | GND | SDA | LH3 | LH2 | GND | SDA | SCL | VTS | S2 | S3 | TH5 | TH4 | SCL | VTS | SDA | GND | LH5 | LH4 | GND | SDA | VTS | SCL | S5 | S4 | TH7 | TH6 | SCL | VTS | SDA | GND | LH6 | GND | SDA | VTS | LH7 | SCL | S6 | S7 | TH8 | TH9 | SCL | VTS | SDA | GND | LH8 | GND | SDA | VTS | SCL | LH9 | S8 | S9 | TH11 | TH10 | SCL | VTS | LH11 | SDA | GND | LH10 | GND | SDA | VTS | SCL | S11 | S10 | Temperature Sensor Board V2.2 | Terawatt Productions Inc. Nov 1, 2018.